# EAGLE design compass (EAGLE 5.11)
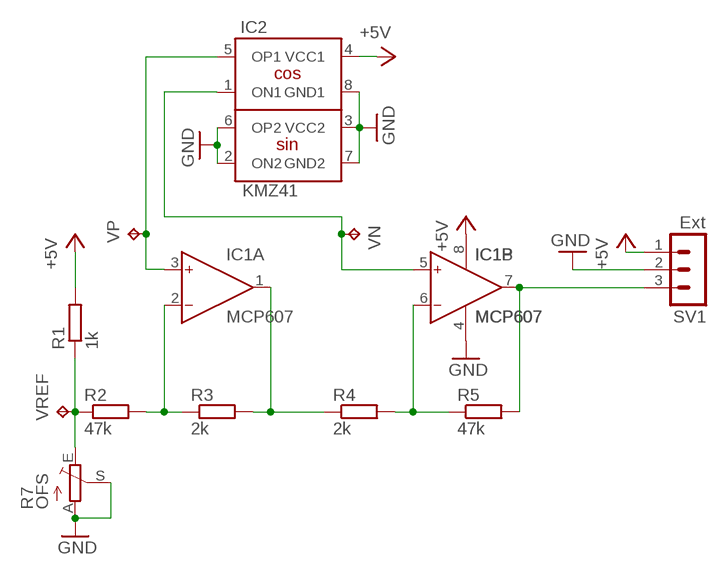
[diagram p0: schematic, sheet 1]

## Parts
IC1  MCP607  AD712R  [SO8]
IC2  KMZ41  KMZ41-SO8-SOT96-1  [SO-08]
R1  1k  R-EU_0204/7  [0204/7]
R2  47k  R-EU_0204/7  [0204/7]
R3  2k  R-EU_0204/7  [0204/7]
R4  2k  R-EU_0204/7  [0204/7]
R5  47k  R-EU_0204/7  [0204/7]
R7  OFS  TRIM_EU-ECP10P  [ECP10P]
SV1  Ext  MA03-1  [MA03-1]
VN  TPPAD1-13  [P1-13]
VP  TPPAD1-13  [P1-13]
VREF  TPPAD1-13  [P1-13]

## Nets
+5V: IC1.8(P:V+) IC2.4(VCC1) R1.2 SV1.1
GND: IC1.4(P:V-) IC2.2(ON2) IC2.3(VCC2) IC2.6(OP2) IC2.7(GND2) IC2.8(GND1) R7.A R7.S SV1.2
N$1: R1.1 R2.1 R7.E VREF.TP
N$2: IC1.3(A:IN+) IC2.5(OP1) VP.TP
N$3: IC1.2(A:IN-) R2.2 R3.1
N$4: IC1.1(A:OUT) R3.2 R4.1
N$5: IC1.6(B:IN-) R4.2 R5.1
N$6: IC1.7(B:OUT) R5.2 SV1.3
N$7: IC1.5(B:IN+) IC2.1(ON1) VN.TP

## Library data of the parts
IC1 = analog-devices:AD712: Dual Precision, Low Cost, High Speed BiFET Op Amp Source: http://www.analog.com/static/imported-files/data_sheets/AD712.pdf; MF: ALTERA CORPORATION; MPN: AD712KRZ; OC_FARNELL: 1263975; OC_NEWARK: 59K4556
IC2 = shmuma:KMZ41-SO8: Magnetic field sensor
R1-R5 = rcl:R-EU_: RESISTOR, European symbol
R7 = pot:TRIM_EU-: POTENTIOMETER
SV1 = con-lstb:MA03-1: PIN HEADER; OC_FARNELL: unknown; OC_NEWARK: unknown
VN VP VREF = testpad:TP: Test pad

## Board
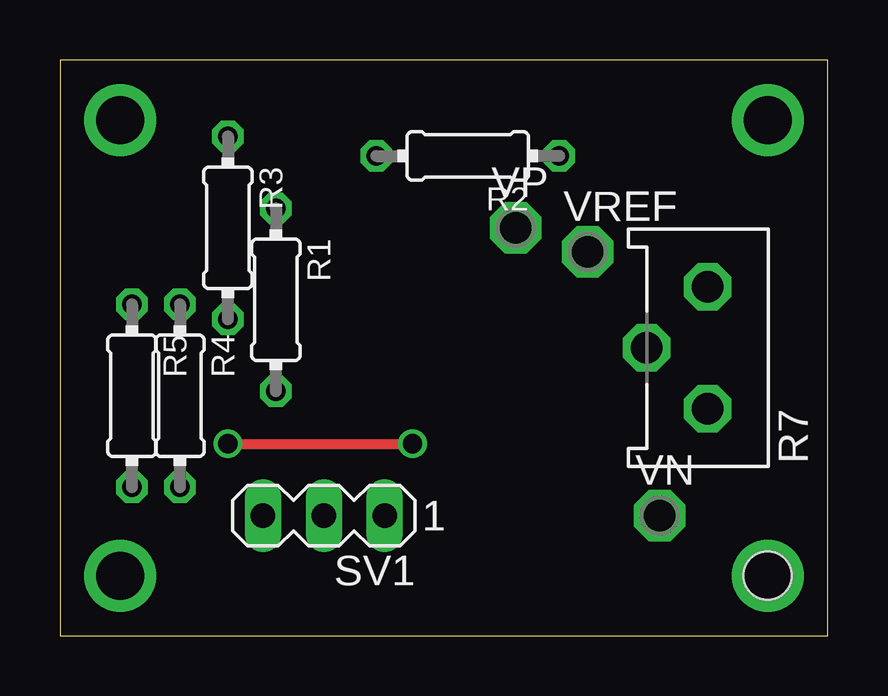
[diagram p1: board, top side]
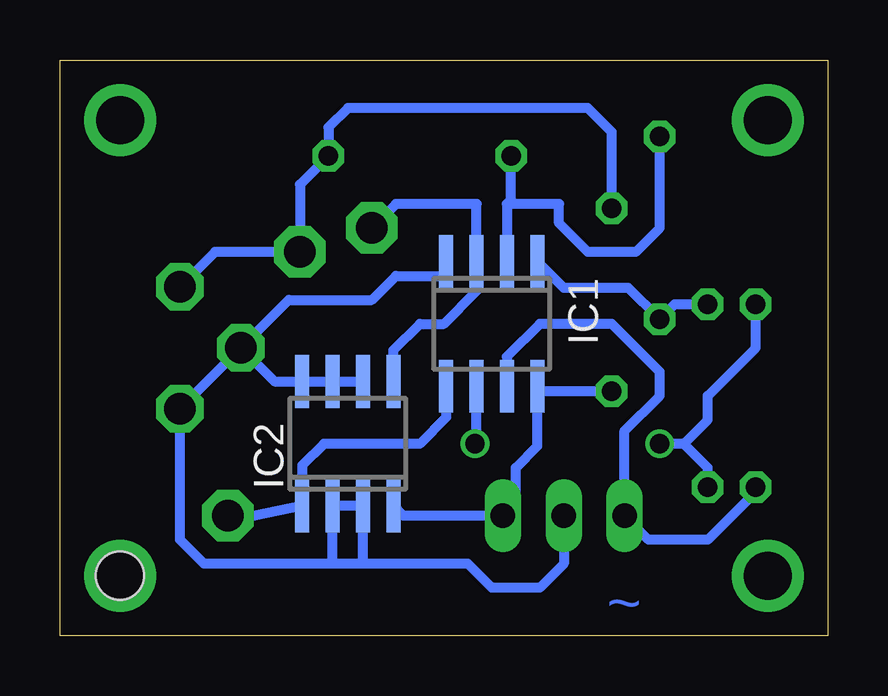
[diagram p2: board, bottom side, seen from below]

Size 32 x 24 mm. Coordinates in mm from the lower left corner, seen from the top.
Outline: 0,0 32,0 32,24 0,24 0,0
Copper layers (1*16): Top 0.035mm / dielectric 1.5mm / Bottom 0.035mm
Design rules "default": minimum track width 10mil, minimum drill 24mil, track to track 8mil, track to pad 8mil, pad to pad 8mil, via to via 8mil, smd to smd 8mil, copper to edge 40mil, drill to drill 8mil, minimum pad ring 10mil, minimum via ring 8mil, stop-mask expansion 4mil, vias tented up to drill 0mil, thermal gap 10mil
Holes 2 mm at 29.5,2.5

### Footprints (pad centres in the part's own frame; a part is rotated, then mirrored left to right if it is on the bottom)
SO8 = smd 0.6 x 2.2: 1 -1.905,-2.6; 2 -0.635,-2.6; 3 0.635,-2.6; 4 1.905,-2.6; 5 1.905,2.6; 6 0.635,2.6; 7 -0.635,2.6; 8 -1.905,2.6
SO-08 = smd 0.6 x 2.2: 1 -1.905,-2.6; 2 -0.635,-2.6; 3 0.635,-2.6; 4 1.905,-2.6; 5 1.905,2.6; 6 0.635,2.6; 7 -0.635,2.6; 8 -1.905,2.6
0204/7 = drill 0.813 octagon: 1 -3.81,0; 2 3.81,0
ECP10P = drill 1.321 octagon: A -2.54,0; E 2.54,0; S 0,2.54
MA03-1 = drill 1.016 long: 1 -2.54,0; 2 0,0; 3 2.54,0
P1-13 = drill 1.321 pad 2.159 octagon: TP 0,0

### Placement (x,y rotation side)
IC1  14,13 180 bottom
IC2  20,8 0 bottom
R1  9,14 270 top
R2  17,20 180 top
R3  7,17 270 top
R4  5,10 270 top
R5  3,10 270 top
R7  27,12 90 top
SV1  11,5 180 top
VN  25,5 0 top
VP  19,17 0 top
VREF  22,16 0 top

### Tracks (layer width: path | path; a pad name or v marks a point on that pad's centre or on a via)
+5V
  Bottom 0.406: R1.2 11.88,10.19 IC1.8 12.1,7.91 13,7 13,5.54 SV1.1 17.7,5 IC2.4
GND
  Bottom 0.406: IC2.6 IC2.7 IC2.8 23.06,10.6 R7.S | SV1.2 11,3 12,2 14,2 15,3 19.36,3 | 19.36,3 20.64,3 | 20.64,3 IC2.2 IC2.3 19.36,3 | R7.S R7.A 27,4 26,3 20.64,3 | R7.S 22.46,14 19,14 18,15 16,15 15.9,15.1 IC1.4
N$1
  Bottom 0.406: R7.E 25.54,16 VREF.TP 22,18.81 R2.1 20.81,21.19 20,22 10,22 9,21 R1.1
N$2
  Bottom 0.406: VP.TP 18,18 14.63,18 IC1.3 14.63,14.37 16,13 17,13 18.09,11.9 IC2.5
N$3
  Bottom 0.406: 13.37,18 IC1.2 | R3.1 7,17 8,16 10,16 11.19,17.19 11.19,18 13.37,18 | R2.2 13.19,18.18 13.37,18
N$4
  Bottom 0.406: 12.1,15.81 IC1.1 10.99,14.5 8.31,14.5 R3.2 6.38,13.81 R4.1
N$5  (via drill 0.8)
  Top 0.406: v7,8 v14.7,8
  Bottom 0.406: IC1.6 14.63,8.37 v14.7,8 | R4.2 5,7 6,8 | 6,8 v7,8 | R5.1 3,12 5,10 5,9 6,8
N$6
  Bottom 0.406: IC1.7 13.37,11.63 12,13 9,13 7,11 7,10 8.46,8.54 SV1.3 7.46,4 5,4 3,6 R5.2
N$7
  Bottom 0.406: VN.TP 23.91,5 IC2.1 21.91,7.09 21,8 17,8 15.9,9.09 IC1.5
N$8  (via drill 2)
  other vias: 2.5,21.5
N$9  (via drill 2)
  other vias: 2.5,2.5
N$10  (via drill 2)
  other vias: 29.5,21.5
N$11  (via drill 2)
  other vias: 29.5,2.5

### Text on the board
Bottom: ~